# Altium schematic sheet stm32.SchDoc
size A4
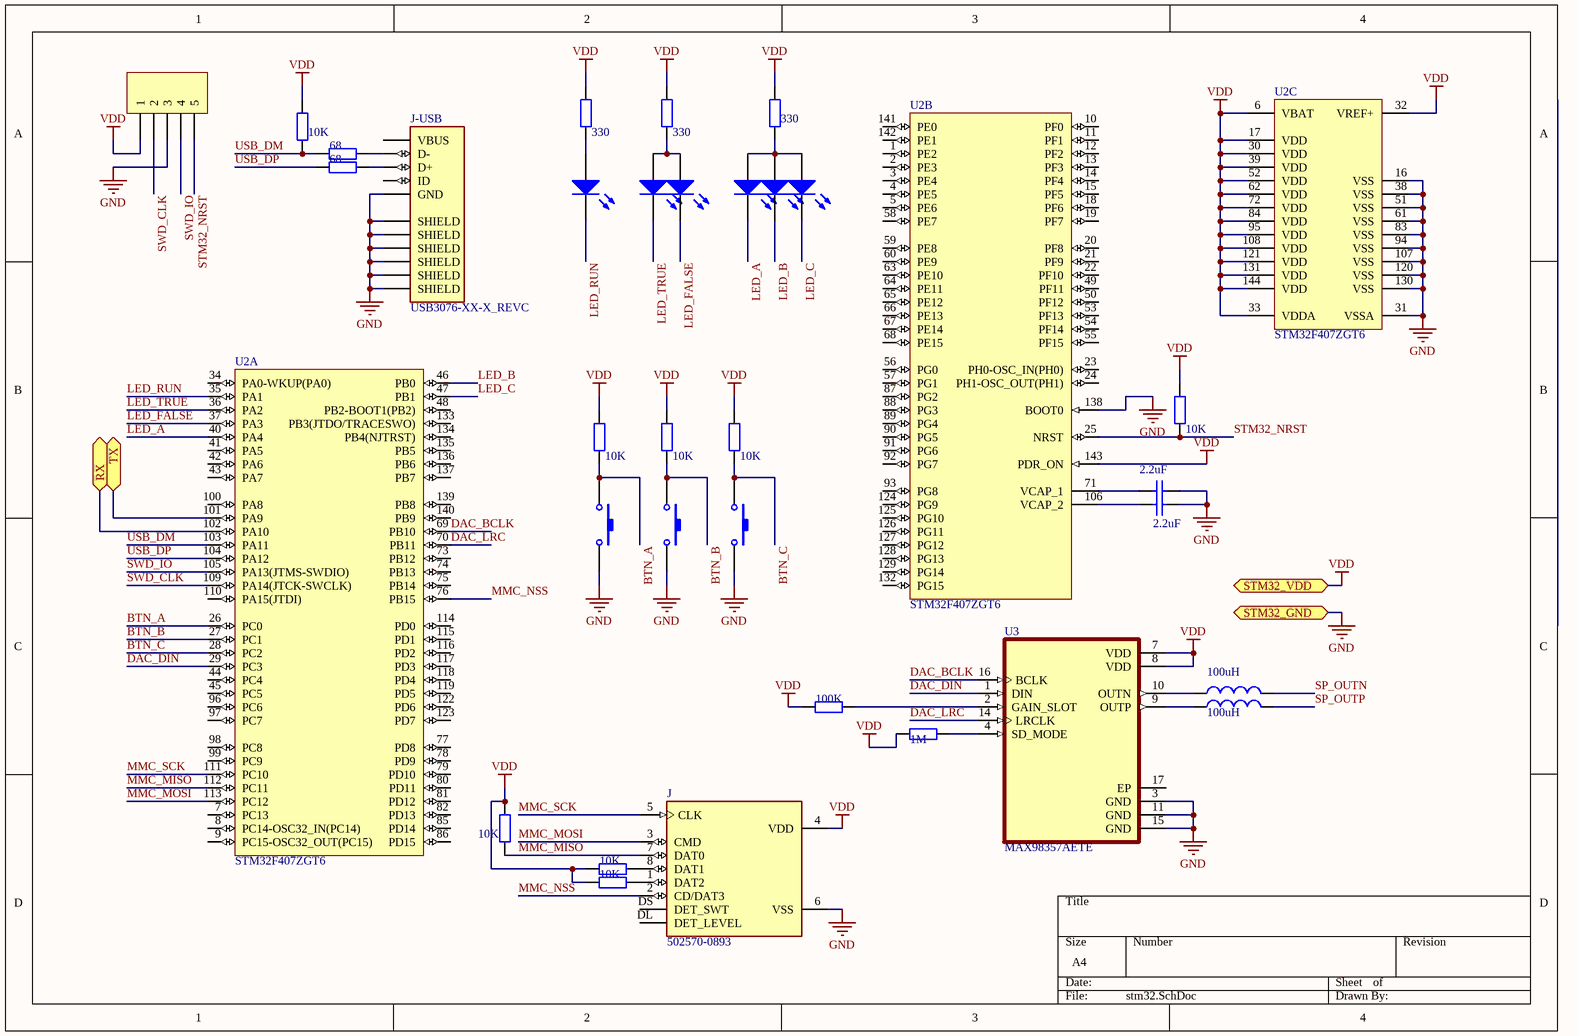
[diagram p0: stm32.SchDoc]

## Parts
D2  LED0  [LED-0]  (value not drawn)
D-BTN1  LED0  [LED-0]  (value not drawn)
D-BTN2  LED0  [LED-0]  (value not drawn)
D-BTN3  LED0  [LED-0]  (value not drawn)
D-LED-ANS1  LED0  [LED-0]  (value not drawn)
D-LED-ANS2  LED0  [LED-0]  (value not drawn)
J  502570-0893  [MOLEX_502570-0893]
J-USB  USB3076-XX-X_REVC  [GCT_USB3076-XX-X_REVC]
L-DAC1  value 100uH  [0402-A]  (hidden comment: Inductor)
L-DAC2  value 100uH  [0402-A]  (hidden comment: Inductor)
P-STM32PROG  Header 5  [HDR1X5]  (value not drawn)
R-BTN1  value 10K  [AXIAL-0.4]  (hidden comment: Res2)
R-BTN2  value 10K  [AXIAL-0.4]  (hidden comment: Res2)
R-BTN3  value 10K  [AXIAL-0.4]  (hidden comment: Res2)
R-DAC1  value 100K  [AXIAL-0.4]  (hidden comment: Res2)
R-DAC3  value 1M  [AXIAL-0.4]  (hidden comment: Res2)
R-LED-ANS1  value 330  [AXIAL-0.4]  (hidden comment: Res2)
R-LED-BTN1  value 330  [AXIAL-0.4]  (hidden comment: Res2)
R-LED-RUN1  value 330  [AXIAL-0.4]  (hidden comment: Res2)
R-MMC1  value 10K  [AXIAL-0.4]  (hidden comment: Res2)
R-MMC2  value 10K  [AXIAL-0.4]  (hidden comment: Res2)
R-MMC3  value 10K  [AXIAL-0.4]  (hidden comment: Res2)
R-STM1  value 10K  [AXIAL-0.4]  (hidden comment: Res2)
R-USB1  value 10K  [AXIAL-0.4]  (hidden comment: Res2)
R-USB2  value 68  [AXIAL-0.4]  (hidden comment: Res2)
R-USB3  value 68  [AXIAL-0.4]  (hidden comment: Res2)
S-BTN1  SW-PB  [SPST-2]  (value not drawn)
S-BTN2  SW-PB  [SPST-2]  (value not drawn)
S-BTN3  SW-PB  [SPST-2]  (value not drawn)
U2  STM32F407ZGT6  [STM-LQFP144_N]  (parts A,B,C of 3)
U3  MAX98357AETE  [QFN50P300X300X80-17N]
VCAP1  value 2.2uF  [RAD-0.3]  (hidden comment: Cap)
VCAP2  value 2.2uF  [RAD-0.3]  (hidden comment: Cap)

## Ports
RX, STM32_GND, STM32_VDD, TX

## Nets
GND: J.6(VSS) J-USB.5(GND) J-USB.6(SHIELD) J-USB.7(SHIELD) J-USB.8(SHIELD) J-USB.9(SHIELD) J-USB.10(SHIELD) J-USB.11(SHIELD) P-STM32PROG.3 S-BTN1.2 S-BTN2.2 S-BTN3.2 U2.16(VSS) U2.31(VSSA) U2.38(VSS) U2.51(VSS) U2.61(VSS) U2.83(VSS) U2.94(VSS) U2.107(VSS) U2.120(VSS) U2.130(VSS) U2.138(BOOT0) U3.3(GND) U3.11(GND) U3.15(GND) VCAP1.2 VCAP2.2 ; port STM32_GND
VDD: J.4(VDD) P-STM32PROG.1 R-BTN1.1 R-BTN2.1 R-BTN3.1 R-DAC1.1 R-DAC3.1 R-LED-ANS1.2 R-LED-BTN1.2 R-LED-RUN1.2 R-MMC1.2 R-MMC2.1 R-MMC3.1 R-STM1.2 R-USB1.2 U2.6(VBAT) U2.17(VDD) U2.30(VDD) U2.32(VREF+) U2.33(VDDA) U2.39(VDD) U2.52(VDD) U2.62(VDD) U2.72(VDD) U2.84(VDD) U2.95(VDD) U2.108(VDD) U2.121(VDD) U2.131(VDD) U2.143(PDR_ON) U2.144(VDD) U3.7(VDD) U3.8(VDD) ; port STM32_VDD
BTN_A: R-BTN1.2 S-BTN1.1 U2.26(PC0)
BTN_B: R-BTN2.2 S-BTN2.1 U2.27(PC1)
BTN_C: R-BTN3.2 S-BTN3.1 U2.28(PC2)
DAC_BCLK: U2.69(PB10) U3.16(BCLK)
DAC_DIN: U2.29(PC3) U3.1(DIN)
DAC_LRC: U2.70(PB11) U3.14(LRCLK)
LED_A: D-BTN1.2(K) U2.40(PA4)
LED_B: D-BTN2.2(K) U2.46(PB0)
LED_C: D-BTN3.2(K) U2.47(PB1)
LED_FALSE: D-LED-ANS2.2(K) U2.37(PA3)
LED_RUN: D2.2(K) U2.35(PA1)
LED_TRUE: D-LED-ANS1.2(K) U2.36(PA2)
MMC_MISO: J.7(DAT0) R-MMC1.1 U2.112(PC11)
MMC_MOSI: J.3(CMD) U2.113(PC12)
MMC_NSS: J.2(CD/DAT3) U2.76(PB15)
MMC_SCK: J.5(CLK) U2.111(PC10)
RX: U2.102(PA10) ; port RX
SP_OUTN: L-DAC1.2
SP_OUTP: L-DAC2.2
STM32_NRST: P-STM32PROG.5 R-STM1.1 U2.25(NRST)
SWD_CLK: P-STM32PROG.2 U2.109(PA14(JTCK-SWCLK))
SWD_IO: P-STM32PROG.4 U2.105(PA13(JTMS-SWDIO))
TX: U2.101(PA9) ; port TX
USB_DM: R-USB1.1 R-USB2.1 U2.103(PA11)
USB_DP: R-USB3.1 U2.104(PA12)
NetD2_1: D2.1(A) R-LED-RUN1.1
NetD-BTN1_1: D-BTN1.1(A) D-BTN2.1(A) D-BTN3.1(A) R-LED-BTN1.1
NetD-LED-ANS1_1: D-LED-ANS1.1(A) D-LED-ANS2.1(A) R-LED-ANS1.1
NetJ-USB_2: J-USB.2(D-) R-USB2.2
NetJ-USB_3: J-USB.3(D+) R-USB3.2
NetJ_1: J.1(DAT2) R-MMC3.2
NetJ_8: J.8(DAT1) R-MMC2.2
NetL-DAC1_1: L-DAC1.1 U3.10(OUTN)
NetL-DAC2_1: L-DAC2.1 U3.9(OUTP)
NetR-DAC1_2: R-DAC1.2 U3.2(GAIN_SLOT)
NetR-DAC3_2: R-DAC3.2 U3.4(SD_MODE)
NetU2_71: U2.71(VCAP_1) VCAP1.1
NetU2_106: U2.106(VCAP_2) VCAP2.1

Not connected (* = marked no-connect by the designer): J DL(DET_LEVEL) DS(DET_SWT); J-USB 1(VBUS) 4(ID); U2 1(PE2) 2(PE3) 3(PE4) 4(PE5) 5(PE6) 7(PC13) 8(PC14-OSC32_IN(PC14)) 9(PC15-OSC32_OUT(PC15)) 10(PF0) 11(PF1) 12(PF2) 13(PF3) 14(PF4) 15(PF5) 18(PF6) 19(PF7) 20(PF8) 21(PF9) 22(PF10) 23(PH0-OSC_IN(PH0)) 24(PH1-OSC_OUT(PH1)) 34(PA0-WKUP(PA0)) 41(PA5) 42(PA6) 43(PA7) 44(PC4) 45(PC5) 48(PB2-BOOT1(PB2)) 49(PF11) 50(PF12) 53(PF13) 54(PF14) 55(PF15) 56(PG0) 57(PG1) 58(PE7) 59(PE8) 60(PE9) 63(PE10) 64(PE11) 65(PE12) 66(PE13) 67(PE14) 68(PE15) 73(PB12) 74(PB13) 75(PB14) 77(PD8) 78(PD9) 79(PD10) 80(PD11) 81(PD12) 82(PD13) 85(PD14) 86(PD15) 87(PG2) 88(PG3) 89(PG4) 90(PG5) 91(PG6) 92(PG7) 93(PG8) 96(PC6) 97(PC7) 98(PC8) 99(PC9) 100(PA8) 110(PA15(JTDI)) 114(PD0) 115(PD1) 116(PD2) 117(PD3) 118(PD4) 119(PD5) 122(PD6) 123(PD7) 124(PG9) 125(PG10) 126(PG11) 127(PG12) 128(PG13) 129(PG14) 132(PG15) 133(PB3(JTDO/TRACESWO)) 134(PB4(NJTRST)) 135(PB5) 136(PB6) 137(PB7) 139(PB8) 140(PB9) 141(PE0) 142(PE1); U3 17(EP)

## Library data of the parts
D2 D-BTN1-D-BTN3 D-LED-ANS1 D-LED-ANS2 = LED0: Typical INFRARED GaAs LED; Published: 8-Jun-2000; LatestRevisionDate: 08-Jul-2005; LatestRevisionNote: Mech Layer 1 removed.; PackageReference: LED-0; Publisher: Altium Limited; PackageDescription: LED; 2 Leads
J = 502570-0893: 10 _8 + 2_ Position Card Connector Secure Digital - microSDâ„¢ Surface Mount, Right Angle Gold; MF: Molex; Price: None; Package: None; Value: *; MP: 502570-0893; Availability: Unavailable; SnapEDA_Link: https://www.snapeda.com/parts/502570-0893/Molex/view-part/225170/?ref=snap
J-USB = USB3076-XX-X_REVC: USB - micro B USB 2.0 Receptacle Connector 5 Position Surface Mount, Right Angle; Through Hole; MP: USB3076-30-A; MF: Global Connector Technology; Availability: Unavailable; SnapEDA_Link: https://www.snapeda.com/parts/USB3076-30-A/Global%20Connector%20Technology/view-part/276912/?ref=snap; Package: None; Price: None; Value: *
L-DAC1 L-DAC2 = Inductor: Code_IEC: 1005; Published: 8-Jun-2000; LatestRevisionDate: 29-May-2009; LatestRevisionNote: IPC-7351 Footprint Added.; PackageReference: 0402-A; Publisher: Altium Limited; PackageDescription: Chip Inductor; Code_JEITA: 0402
P-STM32PROG = Header 5: Header, 5-Pin; LatestRevisionDate: 17-Jul-2002; LatestRevisionNote: Re-released for DXP Platform.; Publisher: Altium Limited
R-BTN1-R-BTN3 R-DAC1 R-DAC3 R-LED-ANS1 R-LED-BTN1 R-LED-RUN1 R-MMC1-R-MMC3 R-STM1 R-USB1-R-USB3 = Res2: Resistor; Published: 8-Jun-2000; LatestRevisionDate: 17-Jul-2002; LatestRevisionNote: Re-released for DXP Platform.; PackageReference: AXIAL-0.4; Publisher: Altium Limited; PackageDescription: Axial Device, Thru-Hole; 2 Leads; 0.4 in Pin Spacing
S-BTN1-S-BTN3 = SW-PB: Switch; Published: 24-Mar-1999; LatestRevisionDate: 17-Jul-2002; LatestRevisionNote: Re-released for DXP Platform.; PackageReference: SPST-2; Publisher: Altium Limited; PackageDescription: Switch; 2 Leads
U2 = STM32F407ZGT6: ARM Cortex-M4 32-bit MCU+FPU, 210 DMIPS, 1024 kB Flash, 192 kB Internal RAM, 114 I/Os, 144-pin LQFP, -40 to 85 degC, Tray; Manufacturer: STMicroelectronics; D/A Converter: 2x12-bit; FLASH Size (Prog) (kB): 1024; I/Os (High Current): 114; Internal RAM Size (kB): 192; Operating Frequency(F) (Processor speed) (MHz): 168; Supply Voltage(Vcc) max (V): 3.6; Supply Voltage(Vcc) min (V): 1.8; DatasheetVersion: Rev. 4; PackageVersion: Rev. 4, 06/2013; PackageReference: LQFP144; PackageDescription: 144-Pin Low Profile Quad Flat Package, 20 x 20 mm Body, 0.5 mm Pitch; Supplier 1: Digi-Key; Supplier Part Number 1: 497-11766-ND; Supplier 2: Newark; Supplier Part Number 2: 73T2334; Supplier 3: Mouser; Supplier Part Number 3: 511-STM32F407ZGT6; Core: ARM Cortex-M4; Packing: Tray; Mounting Technology: Surface Mount; PartNumber: STM32F407ZGT6; ComponentLink1Description: Manufacturer URL; ComponentLink1URL: http://www.st.com/web/en/home.html; ComponentLink2Description: Datasheet; ComponentLink2URL: http://www.st.com/st-web-ui/static/active/en/resource/technical/document/datasheet/DM00037051.pdf; ComponentLink3Description: Package Specification; ComponentLink3URL: http://www.st.com/st-web-ui/static/active/en/resource/technical/document/datasheet/DM00037051.pdf
U3 = MAX98357AETE: Audio Amp Speaker 1-CH Mono 3.2W Class-D 16-Pin TQFN EP T/R; MF: Maxim Integrated; SnapEDA_Link: https://www.snapeda.com/parts/MAX98357AETE/Maxim+Integrated/view-part/?ref=snap; MP: MAX98357AETE; Check_prices: https://www.snapeda.com/parts/MAX98357AETE/Maxim+Integrated/view-part/?ref=eda; Price: None; Purchase-URL: https://pricing.snapeda.com/search/part/MAX98357AETE/?ref=eda; Availability: In Stock; Value: *; Package: None
VCAP1 VCAP2 = Cap: Capacitor; Published: 8-Jun-2000; LatestRevisionDate: 17-Jul-2002; LatestRevisionNote: Re-released for DXP Platform.; PackageReference: RAD-0.3; Publisher: Altium Limited; PackageDescription: Radial Cap, Thru-Hole; 2 Leads; 0.3 in Pin Spacing